# EAGLE design maXTouch Xplained Shield (EAGLE 9.2.2)
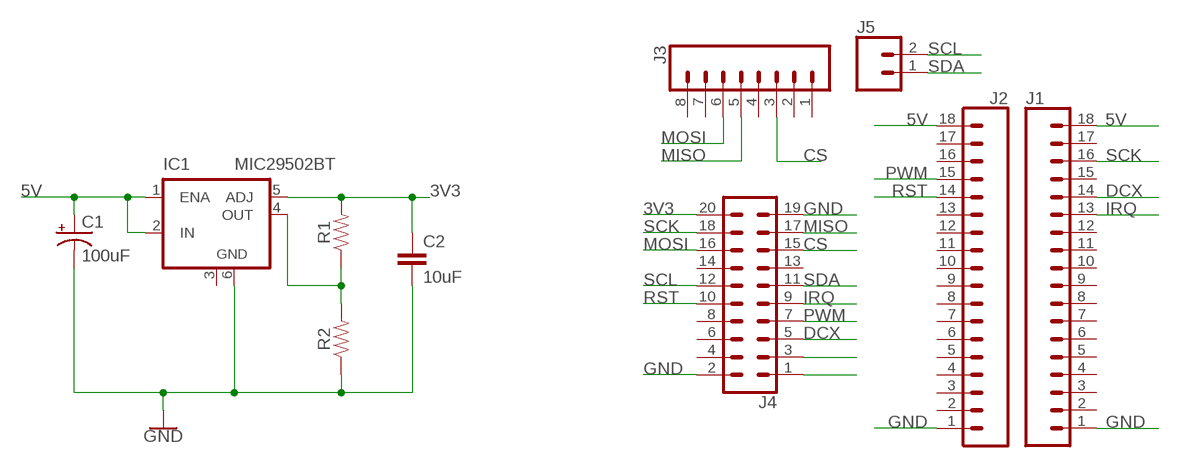
[diagram p0: schematic, sheet 1]

## Parts
C1  100uF  100UF-POLAR-25V-20%(ELEC)  [PANASONIC_D]
C2  10uF  10UF-0805-10V-10%  [0805]
IC1  MIC29502BT  [TO263-5]
J1  CONN_18SILK  [1X18]
J2  CONN_18SILK  [1X18]
J3  CONN_08"  [1X08]
J4  CONN_10X2  [2X10]
J5  CONN_02  [1X02]
R1  RESISTOR0603  [0603]
R2  RESISTOR0603  [0603]

## Nets
3V3: C2.1 IC1.5(ADJ) J4.20 R1.2
5V: C1.+ IC1.1(ENA) IC1.2(IN) J1.18 J2.18
CS: J3.3 J4.15
DCX: J1.14 J4.5
GND: C1.- C2.2 IC1.6(GND) J1.1 J2.1 J4.2 J4.19 R2.1
IRQ: J1.13 J4.9
MISO: J3.5 J4.17
MOSI: J3.6 J4.16
N$2: IC1.4(OUT) R1.1 R2.2
N$13: J4.1
N$14: J4.3
PWM: J2.15 J4.7
RST: J2.14 J4.10
SCK: J1.16 J4.18
SCL: J4.12 J5.2
SDA: J4.11 J5.1
Unconnected: J1.2 J1.3 J1.4 J1.5 J1.6 J1.7 J1.8 J1.9 J1.10 J1.11 J1.12 J1.15 J1.17 J2.2 J2.3 J2.4 J2.5 J2.6 J2.7 J2.8 J2.9 J2.10 J2.11 J2.12 J2.13 J2.16 J2.17 J3.1 J3.2 J3.4 J3.7 J3.8 J4.4 J4.6 J4.8 J4.13 J4.14

## Power pins joined to a net without a drawn wire
GND: IC1.3(GND)

## Library data of the parts
C1 = SparkFun-Capacitors:100UF-POLAR: 100µF polarized capacitors A capacitor is a passive two-terminal electrical component used to store electrical energy temporarily in an electric field.; PROD_ID: CAP-12547
C2 = SparkFun-Capacitors:10UF: 10.0µF ceramic capacitors A capacitor is a passive two-terminal electrical component used to store electrical energy temporarily in an electric field.; PROD_ID: CAP-11330
IC1 = stepper_drivers_etc:MIC29502BT: Adjustable Voltage Regulator
J1 J2 = SparkFun-Connectors:CONN_18: Multi connection point. Often used as Generic Header-pin footprint for 0.1 inch spaced/style header connections On any of the 0.1 inch spaced packages, you can populate with these: Break Away Headers - Straight <https://www.sparkfun.com/products/116> (PRT-00116) Break Away Male Headers - Right Angle <https://www.sparkfun.com/products/553> (PRT-00553) Female Headers <https://www.sparkfun.com/products/115> (PRT-00115) Break Away Headers - Machine Pin <https://www.sparkfun.com/products/117> (PRT-00117) Break Away Female Headers - Swiss Machine Pin <https://www.sparkfun.com/products/743> (PRT-00743) For SCREWTERMINALS and SPRING TERMINALS visit here: Screw Terimnals on SparkFun.com <https://www.sparkfun.com/search/results?term=Screw+Terminals> (5mm/3.5mm/2.54mm spacing) This device is also useful as a general connection point to wire up your design to another part of your project. Our various solder wires solder well into these plated through hole pads. Hook-Up Wire - Assortment (Stranded, 22 AWG) <https://www.sparkfun.com/products/11375> (PRT-11375) Hook-Up Wire - Assortment (Solid Core, 22 AWG) <https://www.sparkfun.com/products/11367> (PRT-11367) View the entire wire category on our website here <https://www.sparkfun.com/categories/141> Special notes: Molex polarized connector foot print use with SKU : PRT-08231 with associated crimp pins and housings. 1MM SMD Version SKU: PRT-10208 NOTES ON THE VARIANTS LOCK and LOCK_LONGPADS... This footprint was designed to help hold the alignment of a through-hole component (i.e. 6-pin header) while soldering it into place. You may notice that each hole has been shifted either up or down by 0.005 of an inch from it's more standard position (which is a perfectly straight line). This slight alteration caused the pins (the squares in the middle) to touch the edges of the holes. Because they are alternating, it causes a "brace" to hold the component in place. 0.005 has proven to be the perfect amount of "off-center" position when using our standard breakaway headers. Although looks a little odd when you look at the bare footprint, once you have a header in there, the alteration is very hard to notice. Also,if you push a header all the way into place, it is covered up entirely on the bottom side.
J3 = SparkFun-Connectors:CONN_08: Multi connection point. Often used as Generic Header-pin footprint for 0.1 inch spaced/style header connections On any of the 0.1 inch spaced packages, you can populate with these: Break Away Headers - Straight <https://www.sparkfun.com/products/116> (PRT-00116) Break Away Male Headers - Right Angle <https://www.sparkfun.com/products/553> (PRT-00553) Female Headers <https://www.sparkfun.com/products/115> (PRT-00115) Break Away Headers - Machine Pin <https://www.sparkfun.com/products/117> (PRT-00117) Break Away Female Headers - Swiss Machine Pin <https://www.sparkfun.com/products/743> (PRT-00743) Arduino Stackable Header - 8 Pin <https://www.sparkfun.com/products/9279> (PRT-09279) For SCREWTERMINALS and SPRING TERMINALS visit here: Screw Terimnals on SparkFun.com <https://www.sparkfun.com/search/results?term=Screw+Terminals> (5mm/3.5mm/2.54mm spacing) This device is also useful as a general connection point to wire up your design to another part of your project. Our various solder wires solder well into these plated through hole pads. Hook-Up Wire - Assortment (Stranded, 22 AWG) <https://www.sparkfun.com/products/11375> (PRT-11375) Hook-Up Wire - Assortment (Solid Core, 22 AWG) <https://www.sparkfun.com/products/11367> (PRT-11367) View the entire wire category on our website here <https://www.sparkfun.com/categories/141> Special notes: Molex polarized connector foot print use with SKU : PRT-08231 with associated crimp pins and housings. 1MM SMD Version SKU: PRT-10208 NOTES ON THE VARIANTS LOCK and LOCK_LONGPADS... This footprint was designed to help hold the alignment of a through-hole component (i.e. 6-pin header) while soldering it into place. You may notice that each hole has been shifted either up or down by 0.005 of an inch from it's more standard position (which is a perfectly straight line). This slight alteration caused the pins (the squares in the middle) to touch the edges of the holes. Because they are alternating, it causes a "brace" to hold the component in place. 0.005 has proven to be the perfect amount of "off-center" position when using our standard breakaway headers. Although looks a little odd when you look at the bare footprint, once you have a header in there, the alteration is very hard to notice. Also,if you push a header all the way into place, it is covered up entirely on the bottom side.; PROD_ID: CONN-08438
J4 = SparkFun-Connectors:CONN_10X2: Multi connection point. Often used as Generic Header-pin footprint for 0.1 inch spaced/style header connections On any of the 0.1 inch spaced packages, you can populate with these: Break Away Headers - Straight <https://www.sparkfun.com/products/116> (PRT-00116) Break Away Male Headers - Right Angle <https://www.sparkfun.com/products/553> (PRT-00553) Female Headers <https://www.sparkfun.com/products/115> (PRT-00115) Break Away Headers - Machine Pin <https://www.sparkfun.com/products/117> (PRT-00117) Break Away Female Headers - Swiss Machine Pin <https://www.sparkfun.com/products/743> (PRT-00743) Special note about the "SPECIAL" package: This was SPECIALLY designed to be used with our Graphic LCD Backpack. Be sure you want to use this! It is not only staggered on each line of header holes, but IT IS ALSO offset of the center point of the top and bottom lines by 5 mil. This causes the headers to lock into place on the "standard" footprint on the LCD screen. The extra squares on the tdocu layer are there simply to reference other pins (if you were to actually populate a longer header than ten long - this is what we do with the backpacks).
J5 = SparkFun-Connectors:CONN_02: Multi connection point. Often used as Generic Header-pin footprint for 0.1 inch spaced/style header connections On any of the 0.1 inch spaced packages, you can populate with these: Break Away Headers - Straight <https://www.sparkfun.com/products/116> (PRT-00116) Break Away Male Headers - Right Angle <https://www.sparkfun.com/products/553> (PRT-00553) Female Headers <https://www.sparkfun.com/products/115> (PRT-00115) Break Away Headers - Machine Pin <https://www.sparkfun.com/products/117> (PRT-00117) Break Away Female Headers - Swiss Machine Pin <https://www.sparkfun.com/products/743> (PRT-00743) For SCREWTERMINALS and SPRING TERMINALS visit here: Screw Terimnals on SparkFun.com <https://www.sparkfun.com/search/results?term=Screw+Terminals> (5mm/3.5mm/2.54mm spacing) This device is also useful as a general connection point to wire up your design to another part of your project. Our various solder wires solder well into these plated through hole pads. Hook-Up Wire - Assortment (Stranded, 22 AWG) <https://www.sparkfun.com/products/11375> (PRT-11375) Hook-Up Wire - Assortment (Solid Core, 22 AWG) <https://www.sparkfun.com/products/11367> (PRT-11367) View the entire wire category on our website here <https://www.sparkfun.com/categories/141> Special notes: Molex polarized connector foot print use with: PRT-08233 with associated crimp pins and housings. 2.54_SCREWTERM for use with PRT-10571. 3.5mm Screw Terminal footprints for PRT-08084 5mm Screw Terminal footprints for use with PRT-08432
R1 R2 = SparkFun-Resistors:RESISTOR: Generic Resistor Package

## Net classes
0 default: width 0.3 mm

## Board
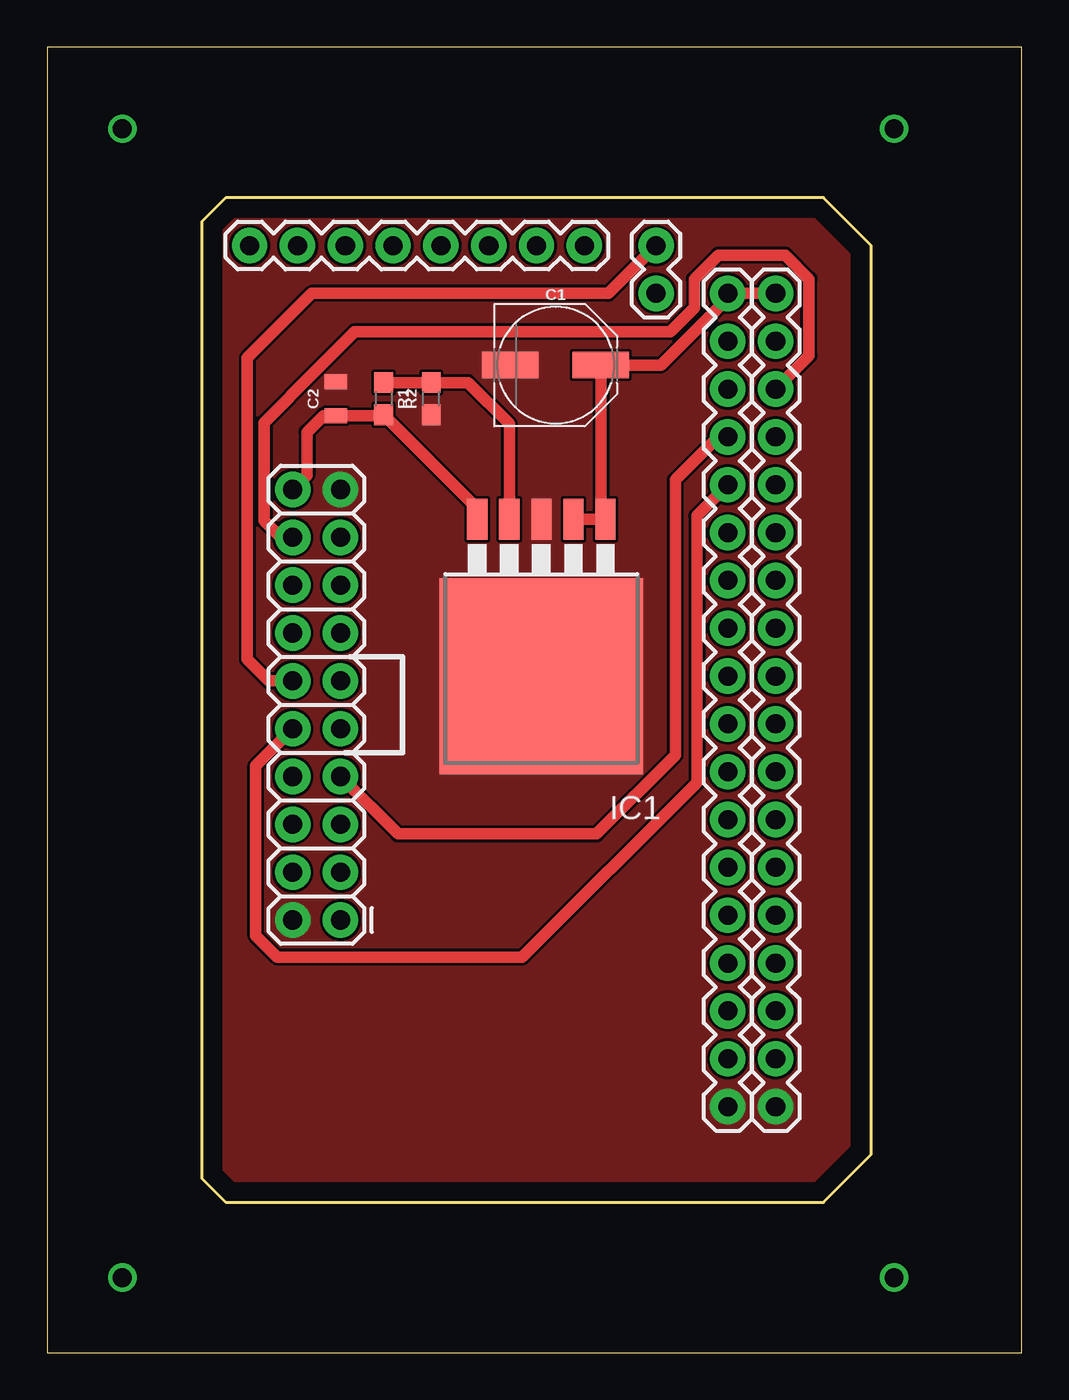
[diagram p1: board, top side]
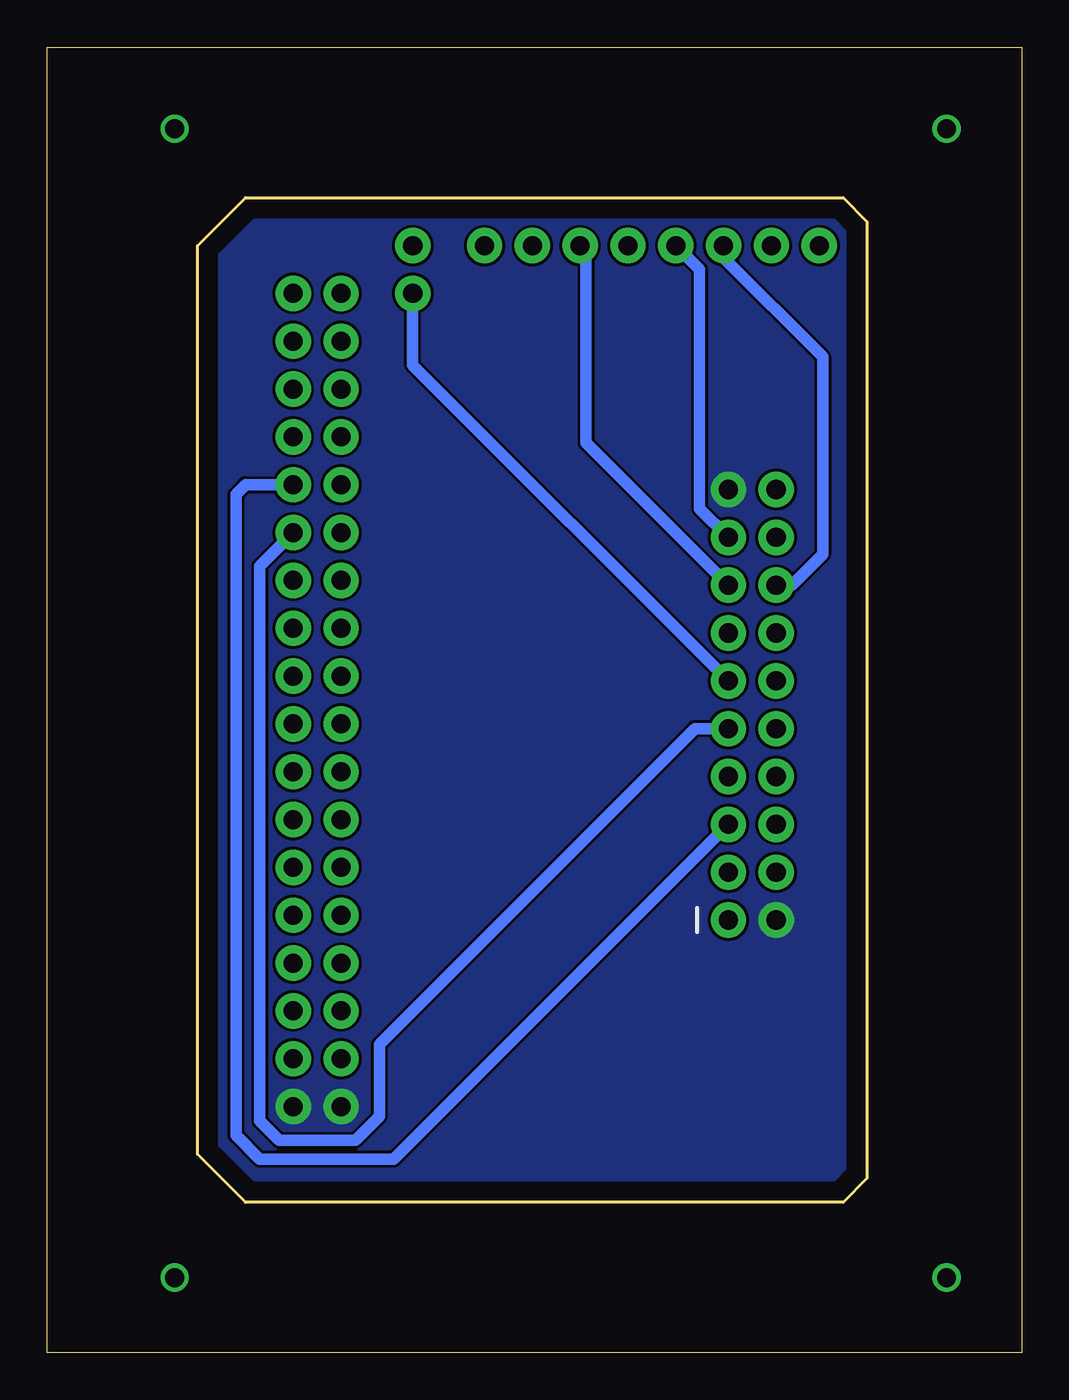
[diagram p2: board, bottom side, seen from below]

Size 51.78 x 69.34 mm. Coordinates in mm from the lower left corner, seen from the top.
Outline: 0,0 51.78,0 51.78,69.34 0,69.34 0,0
Outline: 41.24,61.34 9.49,61.34 8.22,60.07 8.22,9.27 9.49,8 41.24,8 43.78,10.54 43.78,58.8 41.24,61.34
Copper layers (1*16): Top 0.035mm / dielectric 1.5mm / Bottom 0.035mm
Design rules "default": minimum track width 6mil, minimum drill 0.35mm, track to track 6mil, track to pad 6mil, pad to pad 6mil, via to via 6mil, smd to smd 6mil, copper to edge 40mil, drill to drill 6mil, minimum pad ring 10mil, minimum via ring 8mil, stop-mask expansion 4mil, vias tented up to drill 0mil, thermal gap 10mil

### Footprints (pad centres in the part's own frame; a part is rotated, then mirrored left to right if it is on the bottom)
PANASONIC_D = smd 3 x 1.4: + 2.4,0; - -2.4,0
0805 = smd 0.8 x 1.2: 1 -0.9,0; 2 0.9,0
TO263-5 = smd 1.067 x 2.159: 1 -3.404,-5.791; 2 -1.702,-5.791; 3 0,-5.791; 4 1.702,-5.791; 5 3.404,-5.791 | smd 10.8 x 10.41: 6 0,2.54
1X18 = drill 1.016 pad 1.88: 1 0,0; 2 2.54,0; 3 5.08,0; 4 7.62,0; 5 10.16,0; 6 12.7,0; 7 15.24,0; 8 17.78,0; 9 20.32,0; 10 22.86,0; 11 25.4,0; 12 27.94,0; 13 30.48,0; 14 33.02,0; 15 35.56,0; 16 38.1,0; 17 40.64,0; 18 43.18,0
1X08 = drill 1.016 pad 1.88: 1 0,0; 2 2.54,0; 3 5.08,0; 4 7.62,0; 5 10.16,0; 6 12.7,0; 7 15.24,0; 8 17.78,0
2X10 = drill 1.016 pad 1.88: 1 0,0; 2 0,2.54; 3 2.54,0; 4 2.54,2.54; 5 5.08,0; 6 5.08,2.54; 7 7.62,0; 8 7.62,2.54; 9 10.16,0; 10 10.16,2.54; 11 12.7,0; 12 12.7,2.54; 13 15.24,0; 14 15.24,2.54; 15 17.78,0; 16 17.78,2.54; 17 20.32,0; 18 20.32,2.54; 19 22.86,0; 20 22.86,2.54
1X02 = drill 1.016 pad 1.88: 1 0,0; 2 2.54,0
0603 = smd 1.1 x 1: 1 -0.85,0; 2 0.85,0

### Placement (x,y rotation side)
C1  27.02,52.45 0 top
C2  15.34,50.67 90 top
IC1  26.26,38.48 180 top
J1  38.7,13.08 90 top
J2  36.16,13.08 90 top
J3  28.54,58.8 180 top
J4  15.59,22.99 90 top
J5  32.35,56.26 90 top
R1  17.88,50.67 270 top
R2  20.42,50.67 90 top

### Tracks (layer width: path | path; a pad name or v marks a point on that pad's centre or on a via)
3V3
  Top 0.6: 17.67,49.87 R1.2 19.06,48.64 | 13.81,48.89 13.81,46.61 J4.20
  Top 0.61: 13.81,48.89 14.69,49.77 C2.1 17.83,49.77 R1.2 | IC1.5 22.85,44.84 19.06,48.64
5V
  Top 0.6: J2.18 J1.18
  Top 0.61: IC1.2 IC1.1 29.42,44.51 C1.+ 32.61,52.45 36.16,56.01 J2.18
CS
  Bottom 0.6: J4.15 23.15,48.32 23.15,58.48 J3.3
DCX
  Bottom 0.61: J4.5 33.37,10.29 40.48,10.29 41.75,11.56 41.75,45.59 41.24,46.1 J1.14
GND
  pour Bottom (no thermals): 8.22,9.27 9.49,8 41.24,8 43.78,10.54 43.78,58.8 41.24,61.34 9.49,61.34 8.22,60.07
  pour Top (no thermals): 8.22,9.27 9.49,8 41.24,8 43.78,10.54 43.78,58.8 41.24,61.34 9.49,61.34 8.22,60.07
IRQ
  Bottom 0.61: J1.13 40.48,41.78 40.48,12.32 39.47,11.3 35.4,11.3 34.13,12.57 34.13,16.38 17.37,33.15 J4.9
MISO
  Bottom 0.6: J4.17 17.11,44.83 17.11,57.53 J3.5
MOSI
  Bottom 0.6: J4.16 12.22,40.77 10.57,42.42 10.57,52.9 15.84,58.16 J3.6
N$1  (via drill 1)
  other vias: 4,4
N$2
  Top 0.6: R1.1 R2.2
  Top 0.61: R2.2 22.36,51.52 24.56,49.33 IC1.4
N$3  (via drill 1)
  other vias: 4,65
N$4  (via drill 1)
  other vias: 45,4
N$5  (via drill 1)
  other vias: 45,65
PWM
  Top 0.61: J4.7 18.64,27.56 29.19,27.56 33.37,31.74 33.37,46.35 35.66,48.64 J2.15
RST
  Top 0.6: J4.10 11.08,31.18 11.08,22.16 12.22,21.02 25.24,21.02 34.51,30.29 34.51,44.45 J2.14
SCK
  Top 0.61: J1.16 40.48,52.96 40.48,57.02 39.21,58.29 35.66,58.29 34.39,57.02 34.39,55.5 33.12,54.23 16.34,54.23 14.28,52.16 11.53,49.4 11.53,44.2 12.41,43.31 J4.18
SCL
  Top 0.61: J5.2 29.81,56.26 14.07,56.26 10.64,52.83 10.64,36.83 11.78,35.69 J4.12
SDA
  Bottom 0.6: J4.11 32.35,52.45 J5.1